# Altium project XL6019.PrjPcb
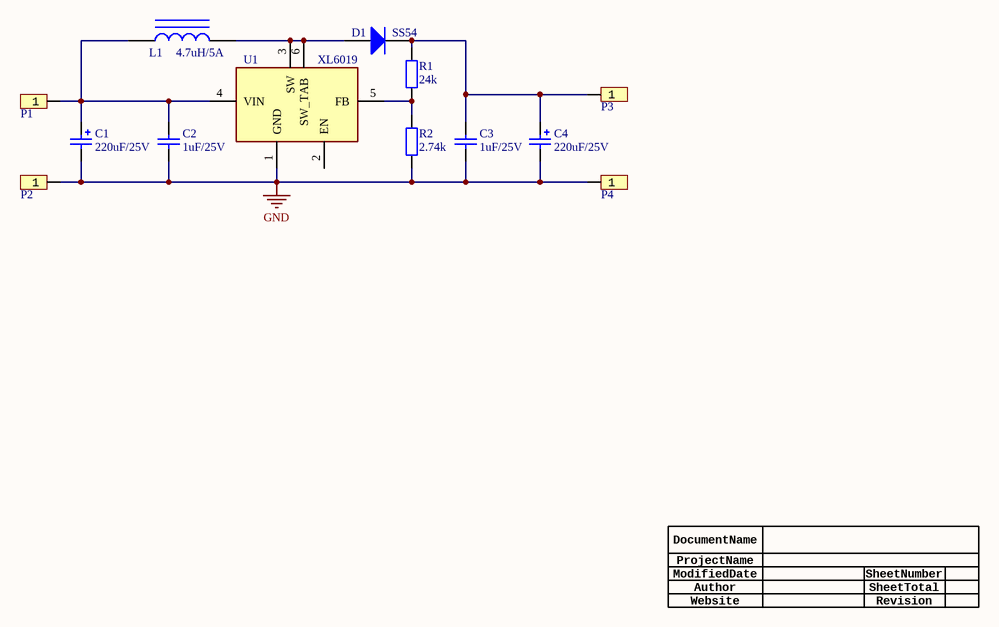
[diagram p0: XL6019.SchDoc]
1 sheet, 13 parts. Net scope: global (net labels, ports and power ports of the same name join across sheets).
Board file: XL6019.PcbDoc

## Sheet XL6019.SchDoc
size 292 x 193 mm; Author: Power Lin; DocumentNumber: 1; SheetNumber: 1; SheetTotal: 1; Website: wiki-power.com

### Parts
C1  220uF/25V  [C_SMD-8X10]
C2  1uF/25V  [CAP-0603]
C3  1uF/25V  [CAP-0603]
C4  220uF/25V  [C_SMD-8X10]
D1  SS54  [DO-214AA/SMB]
L1  4.7uH/5A  [L-0630]
P1  HDR1x2_2.54  [HDR1X1_2.54]  (value not drawn)
P2  HDR1x2_2.54  [HDR1X1_2.54]  (value not drawn)
P3  HDR1x2_2.54  [HDR1X1_2.54]  (value not drawn)
P4  HDR1x2_2.54  [HDR1X1_2.54]  (value not drawn)
R1  24k  [R-0603]
R2  2.74k  [R-0603]
U1  XL6019  [TO-263-5]

### Nets
GND: C1.2 C2.1 C3.1 C4.2 P2.1 P4.1 R2.1 U1.1(GND)
NetC1_1: C1.1 C2.2 L1.1 P1.1 U1.4(VIN)
NetC3_2: C3.2 C4.1 D1.2(K) P3.1 R1.2
NetD1_1: D1.1(A) L1.2 U1.3(SW) U1.6(SW_TAB)
NetR1_1: R1.1 R2.2 U1.5(FB)

Not connected (* = marked no-connect by the designer): U1 2(EN)

### Notes on the sheet
- Author
- DocumentName
- ModifiedDate
- ProjectName
- SheetNumber
- SheetTotal
- Website
- Revision

### Library data of the parts
C1 C4 = CAP-POL: 贴片电容-有极性; ComponentLink1Description: 供应商链接; ComponentLink1URL: http://www.szlcsc.com/product/details_16815.html; Package: 3528; Supplier: LC; SuppliersPartNumber: C16133
C2 C3 = CAP: 贴片电容; ComponentLink1Description: 供应商链接; ComponentLink1URL: http://www.szlcsc.com/product/details_53938.html; Package: 0402; Supplier: LC; SuppliersPartNumber: C52923
D1 = DIODE: 二极管; ComponentLink1Description: 供应商链接; ComponentLink1URL: http://www.szlcsc.com/product/details_23178.html; Package: SMA(DO-214AC); Supplier: LC; SuppliersPartNumber: C22452
L1 = INDUCTOR: 电感; ComponentLink1Description: 供应商链接; ComponentLink1URL: http://www.szlcsc.com/product/details_33003.html; Package: 0402; Supplier: LC; SuppliersPartNumber: C32041
P1-P4 = HDR1x1_2.54: Header
R1 R2 = RES: 贴片电阻; Package: 0805; Supplier: LC; SuppliersPartNumber: C17798
U1 = XL6019: DC-DC; Manufacturer_Name: FTDI Chip; Manufacturer_Part_Number: FT232RL; Datasheet Link: http://www.ftdichip.com/Support/Documents/DataSheets/ICs/DS_FT232R.pdf; Height: 2mm; RS Part Number: 0406580P; RS Price/Stock: http://uk.rs-online.com/web/p/products/0406580P